# Altium schematic sheet SQUID_Channel_DACS.SchDoc: References and DACs
size Letter; PageSetup: Record=PageOptions|CenterHorizontal=True|CenterVertical=True|PrintScale=1.00|XCorrection=1.00|YCorrection=1.00|PrintKind=1|BorderSize=5000000|LeftOffset=0|BottomOffset=0|Orientation=2|PaperLength=1000|PaperWidth=1000|Scale=100|PaperSource=7|PrintQuality=-4|MediaType=1|DitherType=10|PaperKind=Letter|PrintScaleMode=1; Author: Adam Gilbert; CompanyName: McGill University; DrawnBy: J.-F. Cliche & Adam Gilbert; Organization: Altium Limited; Address1: McGill Cosmology; Address2: 3600 University Street; Address3: Montreal, Quebec; Address4: Canada; DocumentNumber: 3; Revision: Rev2; SheetNumber: 3; SheetTotal: 5; ProjectTitle: DAN Squid Controller; ProjectName: DAN Squid Controller
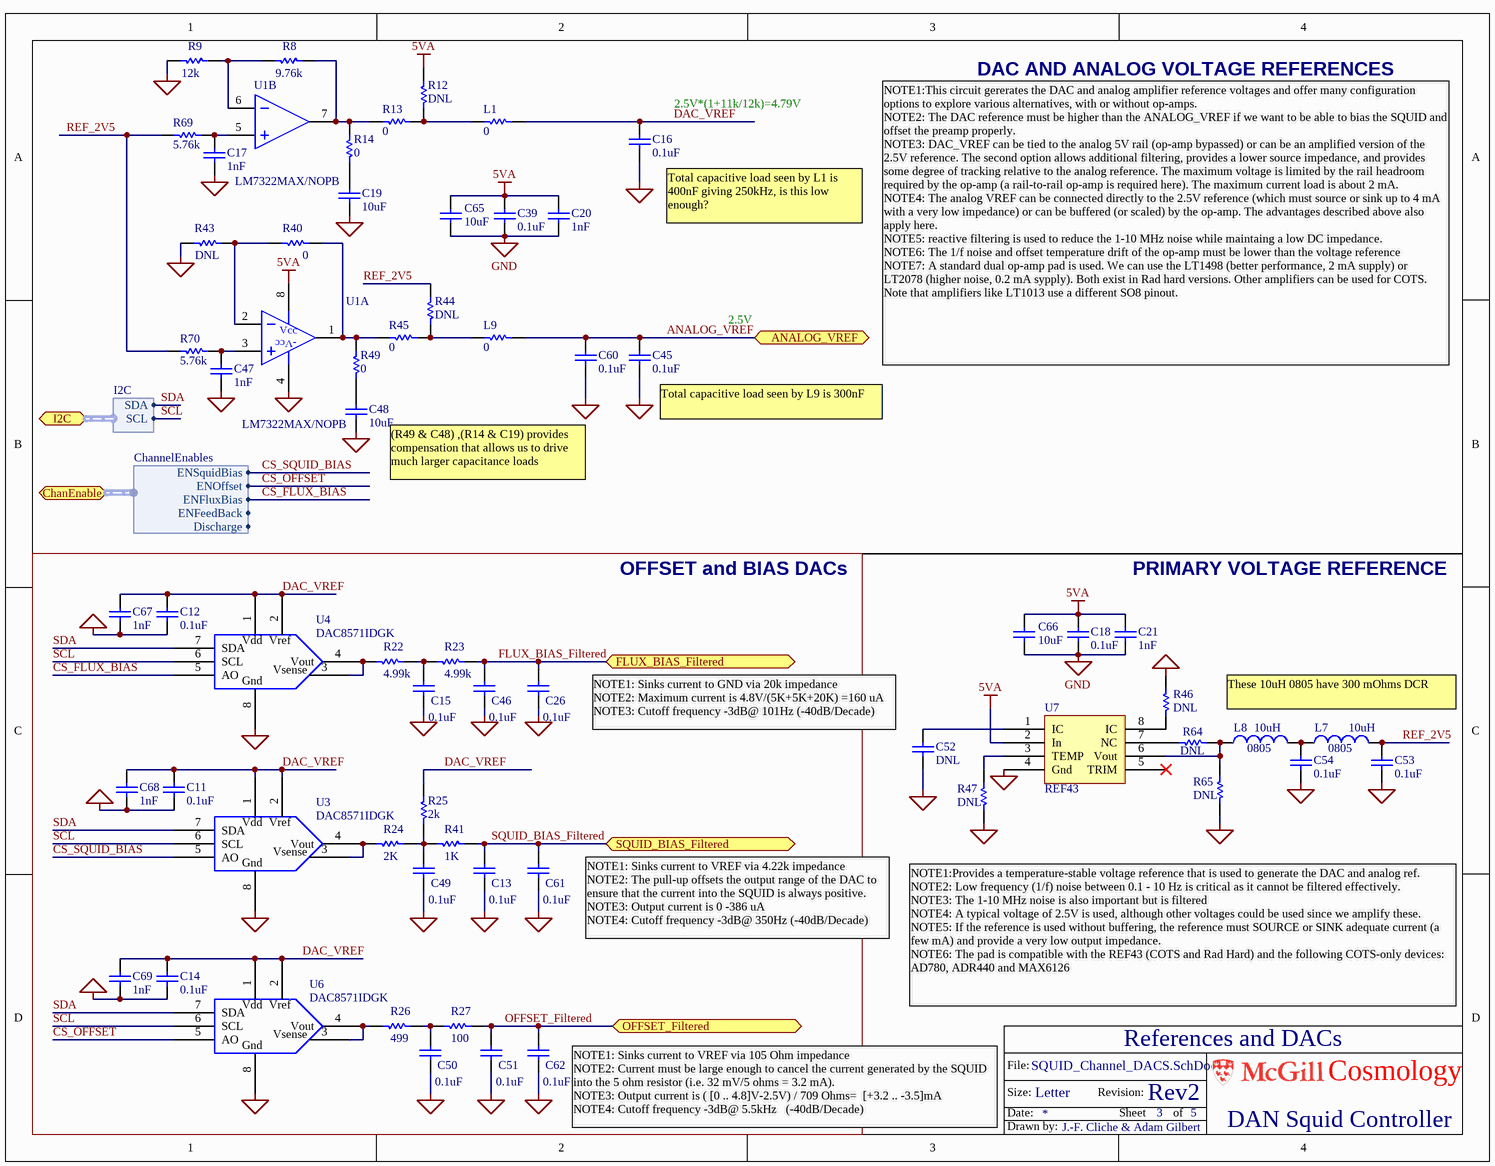
[diagram p0: SQUID_Channel_DACS.SchDoc]

## Parts
C11  0.1uF  [0603]
C12  0.1uF  [0603]
C13  0.1uF  [0603]
C14  0.1uF  [0603]
C15  0.1uF  [0603]
C16  0.1uF  [0603]
C17  1nF  [0603]
C18  0.1uF  [0603]
C19  10uF  [0603]
C20  1nF  [0603]
C21  1nF  [0603]
C26  0.1uF  [0603]
C39  0.1uF  [0603]
C45  0.1uF  [0603]
C46  0.1uF  [0603]
C47  1nF  [0603]
C48  10uF  [0603]
C49  0.1uF  [0603]
C50  0.1uF  [0603]
C51  0.1uF  [0603]
C52  DNL  [0603]
C53  0.1uF  [0603]
C54  0.1uF  [0603]
C60  0.1uF  [0603]
C61  0.1uF  [0603]
C62  0.1uF  [0603]
C65  value 10uF  [CC3225-1210]  (hidden comment: 10uF, 1210)
C66  value 10uF  [CC3225-1210]  (hidden comment: 10uF, 1210)
C67  1nF  [0603]
C68  1nF  [0603]
C69  1nF  [0603]
L1  0  [0603]
L7  10uH  [0805]
L8  10uH  [0805]
L9  0  [0603]
R8  9.76k  [0603]
R9  12k  [0603]
R12  DNL  [0603]
R13  0  [0603]
R14  0  [0603]
R22  4.99k  [0603]
R23  4.99k  [0603]
R24  2k  [0603]
R25  2k  [0603]
R26  499  [0603]
R27  100  [0603]
R40  0  [0603]
R41  1k  [0603]
R43  DNL  [0603]
R44  DNL  [0603]
R45  0  [0603]
R46  DNL  [0603]
R47  DNL  [0603]
R49  0  [0603]
R64  DNL  [0603]
R65  DNL  [0603]
R69  5.76k  [0603]
R70  5.76k  [0603]
U1  LM7322MAX/NOPB  [SO8]  (parts A,B of 2)
U3  DAC8571IDGK  [MSOP-8]
U4  DAC8571IDGK  [MSOP-8]
U6  DAC8571IDGK  [MSOP-8]
U7  REF43  [SO8]

## Blocks framed on the sheet
OFFSET and BIAS DACs: C11-C15 C26 C46 C49-C51 C61 C62 C67-C69 R22-R27 R41 U3 U4 U6

## Ports
ANALOG_VREF, ChanEnable (harness ChannelEnables), FLUX_BIAS_Filtered, I2C (harness I2C), OFFSET_Filtered, SQUID_BIAS_Filtered

## Harnesses
I2C: SDA, SCL
ChannelEnables: ENSquidBias, ENOffset, ENFluxBias, ENFeedBack, Discharge

## Nets
5VA: C18.2 C20.2 C21.2 C39.2 C65.2 C66.2 R12.1 U1.8(VDD) U7.2(In)
GND: C11.2 C12.2 C13.2 C14.1 C15.2 C16.1 C17.1 C18.1 C19.1 C20.1 C21.1 C26.2 C39.1 C45.1 C46.2 C47.1 C48.1 C49.2 C50.2 C51.2 C52.1 C53.1 C54.1 C60.1 C61.2 C62.2 C65.1 C66.1 C67.1 C68.1 C69.1 R9.2 R43.2 R46.2 R47.1 R65.1 U1.4(GND) U3.8(Gnd) U4.8(Gnd) U6.8(Gnd) U7.4(Gnd)
ANALOG_VREF: C45.2 C60.2 L9.1 ; port ANALOG_VREF
CS_FLUX_BIAS: U4.5(AO) ; port ChanEnable.ENFluxBias
CS_OFFSET: U6.5(AO) ; port ChanEnable.ENOffset
CS_SQUID_BIAS: U3.5(AO) ; port ChanEnable.ENSquidBias
DAC_VREF: C11.1 C12.1 C14.2 C16.2 C67.2 C68.2 C69.2 L1.1 R25.2 U3.1(Vdd) U3.2(Vref) U4.1(Vdd) U4.2(Vref) U6.1(Vdd) U6.2(Vref)
FLUX_BIAS_Filtered: C26.1 C46.1 R23.2 ; port FLUX_BIAS_Filtered
OFFSET_Filtered: C51.1 C62.1 R27.2 ; port OFFSET_Filtered
REF_2V5: C53.2 L7.1 R44.1 R69.2 R70.2
SCL: U3.6(SCL) U4.6(SCL) U6.6(SCL) ; port I2C.SCL
SDA: U3.7(SDA) U4.7(SDA) U6.7(SDA) ; port I2C.SDA
SQUID_BIAS_Filtered: C13.1 C61.1 R41.2 ; port SQUID_BIAS_Filtered
NetC15_1: C15.1 R22.2 R23.1
NetC17_2: C17.2 R69.1 U1.5(IN+)
NetC19_2: C19.2 R14.2
NetC47_2: C47.2 R70.1 U1.3(IN+)
NetC48_2: C48.2 R49.2
NetC49_1: C49.1 R24.2 R25.1 R41.1
NetC50_1: C50.1 R26.2 R27.1
NetC52_2: C52.2 U7.1(IC)
NetC54_2: C54.2 L7.2 L8.1
NetL1_2: L1.2 R12.2 R13.2
NetL8_2: L8.2 R64.1 R65.2 U7.6(Vout)
NetL9_2: L9.2 R44.2 R45.2
NetR8_1: R8.1 R9.1 U1.6(IN-)
NetR8_2: R8.2 R13.1 R14.1 U1.7(OUT)
NetR22_1: R22.1 U4.3(Vsense) U4.4(Vout)
NetR24_1: R24.1 U3.3(Vsense) U3.4(Vout)
NetR26_1: R26.1 U6.3(Vsense) U6.4(Vout)
NetR40_1: R40.1 R43.1 U1.2(IN-)
NetR40_2: R40.2 R45.1 R49.1 U1.1(OUT)
NetR46_1: R46.1 U7.8(IC)
NetR47_2: R47.2 U7.3(TEMP)
NetR64_2: R64.2 U7.7(NC)

Not connected (* = marked no-connect by the designer): U7 5(TRIM)*

## Notes on the sheet
- DAC AND ANALOG VOLTAGE REFERENCES
- (near C16) 2.5V*(1+11k/12k)=4.79V
- (near C16) Total capacitive load seen by L1 is 400nF giving 250kHz, is this low enough?
- 2.5V
- NOTE1:This circuit gererates the DAC and analog amplifier reference voltages and offer many configuration options to explore various alternatives, with or without op-amps.
  NOTE2: The DAC reference must be higher than the ANALOG_VREF if we want to be able to bias the SQUID and offset the preamp properly.
  NOTE3: DAC_VREF can be tied to the analog 5V rail (op-amp bypassed) or can be an amplified version of the  2.5V reference. The second option allows additional filtering, provides a lower source impedance, and provides some degree of tracking relative to the analog reference. The maximum voltage is limited by the rail headroom required by the op-amp (a rail-to-rail op-amp is required here). The maximum current load is about 2 mA.
  NOTE4: The analog VREF can be connected directly to the 2.5V reference (which must source or sink up to 4 mA with a very low impedance) or can be buffered (or scaled) by the op-amp. The advantages described above also apply here.
  NOTE5: reactive filtering is used to reduce the 1-10 MHz noise while maintaing a low DC impedance.
  NOTE6: The 1/f noise and offset temperature drift of the op-amp must be lower than the voltage reference
  NOTE7: A standard dual op-amp pad is used. We can use the LT1498 (better performance, 2 mA supply) or LT2078 (higher noise, 0.2 mA sypply). Both exist in Rad hard versions. Other amplifiers can be used for COTS. Note that amplifiers like LT1013 use a different SO8 pinout.
- (near C45) Total capacitive load seen by L9 is 300nF
- (near C48) (R49 & C48) ,(R14 & C19) provides compensation that allows us to drive much larger capacitance loads
- PRIMARY VOLTAGE REFERENCE
- These 10uH 0805 have 300 mOhms DCR
- (near C52) NOTE1: Sinks current to GND via 20k impedance
  NOTE2: Maximum current is 4.8V/(5K+5K+20K) =160 uA
  NOTE3: Cutoff frequency -3dB@ 101Hz (-40dB/Decade)
- (near C61) NOTE1: Sinks current to VREF via 4.22k impedance
  NOTE2: The pull-up offsets the output range of the DAC to ensure that the current into the SQUID is always positive.
  NOTE3: Output current is 0 -386 uA
  NOTE4: Cutoff frequency -3dB@ 350Hz (-40dB/Decade)
- NOTE1:Provides a temperature-stable voltage reference that is used to generate the DAC and analog ref.
  NOTE2: Low frequency (1/f) noise between 0.1 - 10 Hz is critical as it cannot be filtered effectively.
  NOTE3: The 1-10 MHz noise is also important but is filtered
  NOTE4: A typical voltage of 2.5V is used, although other voltages could be used since we amplify these.
  NOTE5: If the reference is used without buffering, the reference must SOURCE or SINK adequate current (a few mA) and provide a very low output impedance.
  NOTE6: The pad is compatible with the REF43 (COTS and Rad Hard) and the following COTS-only devices:  AD780, ADR440 and MAX6126
- (near C62) NOTE1: Sinks current to VREF via 105 Ohm impedance
  NOTE2: Current must be large enough to cancel the current generated by the SQUID into the 5 ohm resistor (i.e. 32 mV/5 ohms = 3.2 mA).
  NOTE3: Output current is ( [0 .. 4.8]V-2.5V) / 709 Ohms=  [+3.2 .. -3.5]mA
  NOTE4: Cutoff frequency -3dB@ 5.5kHz   (-40dB/Decade)
- File:
- Size:
- Date:
- Letter
- Revision:
- Sheet
- of
- Cosmology
- Drawn by:
- (in symbol LMH6628, part A) Vcc; -Vcc

## Library data of the parts
C11-C15 C18 C26 C39 C46 C49-C54 C61 C62 = Cap0603: Capacitor, Ceramic, 0603; Part Constraints: 0.1uF 16V 10% X7R; Manufacturer: Generic; Supplier 1: Digi-Key; Supplier Part Number 1: 399-1096-1-ND
  C11-C15 C18 C26 C39 C46 C49-C51 C53 C54 C61 C62: Value: 0.1uF
  C52: Value: DNL
C16 C45 C60 = Cap0603: Capacitor, Ceramic, 0603; Manufacturer: Generic; Part Constraints: 0.1uF 16V 10% X7R; Supplier 1: Digi-Key; Supplier Part Number 1: 399-1096-1-ND; Value: 0.1uF
C17 C20 C21 C47 C67-C69 = Cap0603: Capacitor, Ceramic, 0603; Part Constraints: 1nF 50V 10% X7R 0603; Manufacturer: Generic; Value: 1nF; Supplier 1: Digi-Key; Supplier Part Number 1: 399-1082-1-ND
C19 C48 = Cap0603: Capacitor, Ceramic, 0603; Manufacturer: Generic; Part Constraints: CAP CER 10UF 10V 20% X5R 0603; Supplier 1: Digi-Key; Supplier Part Number 1: 587-2562-1-ND; Value: 10uF
C65 C66 = CAP 1210: Capacitor, Ceramic, 1210; Manufacturer Part Number: 1206YD106KAT2A; Manufacturer: AVX Corporation; Part Constraints: 10uF 1210 16V X5R <=1.78mm height; Voltage: 16V; Footprint: 1210; Supplier 1: Digikey; Supplier Part Number 1: 478-1573-1-ND
L1 L9 R13 R14 R40 R45 R49 = Res0603: RES 0603; Manufacturer: Generic; Part constraints: 0 1/10W 1% 100ppm/C 0603; Manufacturer Part Number 1: e.g CRCW0603 series; Value: 0; Supplier 1: Digi-Key; Supplier Part Number 1: 541-0.0GCT-ND
L7 L8 = Inductor0603: Inductor 0805; PartConstraints: INDUCTOR 10UH 100MA 20% 0805; Manufacturer: TDK Corporation; Part Constraints: GLFR2012T100M-LR; Resistance: <300mOhm; CurrentRating: 100mA; Inductance: 10uH; Supplier 1: Digi-Key; Supplier Part Number 1: 445-3614-1-ND
R8 = Res0603: RES 0603; Manufacturer: Generic; Part Constraints: RES 9.76K OHM 1/10W 1% 0603 SMD; Manufacturer Part Number 1: e.g CRCW0603 series; Value: 9.76k; Supplier 1: Digi-Key; Supplier Part Number 1: 541-9.76KHCT-ND
R9 = RES 0603: Manufacturer: Generic; Part Constraints: RES 12.0K OHM 1/10W 1% 0603 SMD; Manufacturer Part Number 1: e.g CRCW0603 series; Value: 12k; Supplier 1: Digi-Key; Supplier Part Number 1: 541-12.0KHCT-ND
R12 R44 = Res0603: RES 0603; Manufacturer: Generic; Manufacturer Part Number 1: e.g CRCW0603 series; Value: DNL; Part constraints: DNL
R22 R23 = Res0603: RES 0603; Manufacturer: Generic; Part constraints: RES 4.99K OHM 1/10W 1% 0603 SMD; Manufacturer Part Number 1: e.g CRCW0603 series; Value: 4.99k; Supplier 1: Digi-Key; Supplier Part Number 1: 541-4.99KHCT-ND
R24 R25 = Res0603: RES 0603; Manufacturer: Generic; Part constraints: RES 2.00K OHM 1/10W 1% 0603 SMD; Manufacturer Part Number 1: e.g CRCW0603 series; Supplier 1: Digi-Key; Supplier Part Number 1: 541-2.00KHCT-ND
  R24: Value: 2K
  R25: Value: 2k
R26 = Res0603: RES 0603; Manufacturer: Generic; Manufacturer Part Number 1: e.g CRCW0603 series; Part constraints: 499 1/10W 1% 100ppm/C 0603; Value: 499; Supplier 1: Digi-Key; Supplier Part Number 1: 541-499HCT-ND
R27 = Res0603: RES 0603; Manufacturer: Generic; Manufacturer Part Number 1: e.g CRCW0603 series; Part constraints: RES 100 OHM 1/10W 1% 0603 SMD; Value: 100; Supplier 1: Digi-Key; Supplier Part Number 1: 541-100HCT-ND
R41 = Res0603: RES 0603; Manufacturer: Generic; Part constraints: 1K 1/10W 1% 100ppm/C 0603; Manufacturer Part Number 1: e.g CRCW0603 series; Value: 1K; Supplier 1: Digi-Key; Supplier Part Number 1: 541-1.00KHTR-ND
R43 R47 R65 = RES 0603: Manufacturer: Generic; Manufacturer Part Number 1: e.g CRCW0603 series; Value: DNL; Part constraints: DNL
R46 = RES 0603: Manufacturer: Generic; Manufacturer Part Number 1: e.g CRCW0603 series; Tolerance: 1%; Power: 1/10W; TempCoef: 100ppm/C; Value: DNL; Part Constraints: DNL
R64 = RES 0603: Manufacturer: Generic; Manufacturer Part Number 1: e.g CRCW0603 series; Part constraints: 0 1/10W 1% 100ppm/C 0603; Value: DNL; Supplier 1: Digi-Key; Supplier Part Number 1: 541-0.0GCT-ND
R69 R70 = Res0603: RES 0603; Manufacturer: Generic; Part Constraints: RES 5.76K OHM 1/10W 1% 0603 SMD; Manufacturer Part Number 1: e.g CRCW0603 series; Value: 5.76k; Supplier 1: Digi-Key; Supplier Part Number 1: 541-5.76KHCT-ND
U1 = LMH6628: IC OP AMP DUAL 2CH LN 8-SOIC; Manufacturer: Texas Instruments; Amplifier Type: Voltage Feedback; Number of Circuits: 2; Category: Integrated Circuits (ICs); Output Type: -; Operating Temperature: -40°C ~ 85°C; Mounting Type: Surface Mount; Package / Case: 8-SOIC (0.154", 3.90mm Width); Supplier Device Package: 8-SOIC; Packaging: Tube; Supplier 1: Digi-Key; Supplier Part Number 1: 296-35309-1-ND; Part Constraints: LM7322MAX/NOPB
U3 U4 U6 = DAC8571IDGKR: IC DAC 16BIT I2C V-OUT LP 8-MSOP; Manufacturer 1: Texas Instruments; Category 1: Integrated Circuits (ICs); Settling Time: 12µs; Number of Bits: 16; Data Interface: I²C, Serial; Number of Converters: 1; Voltage Supply Source: Single Supply; Number of Outputs and Type: 1 Voltage, Unipolar; Sampling Rate (Per Second): 43k; Supplier 1: Digi-Key; Manufacturer Part Number 1: DAC8571IDGKR; RoHS 1: RoHS Compliant; Description 1: IC DAC 16BIT I2C V-OUT LP 8-MSOP; Stock 1: 21077; Pricing 1: 1=7.6, 10=6.839, 25=6.2192, 100=3.9792, 250=3.9054, 500=3.83172, 750=3.75803 (CAD); Power Dissipation (Max): -; Operating Temperature: -40°C ~ 105°C; Mounting Type: Surface Mount; Package / Case: 8-TSSOP, 8-MSOP (0.118", 3.00mm Width); Supplier Device Package: 8-MSOP; Packaging: Cut Tape (CT); ComponentLink1URL: http://www.ti.com/lit/ds/symlink/dac8571.pdf; ComponentLink1Description: http://www.ti.com/lit/ds/symlink/dac8571.pdf; Supplier Part Number 1: 296-14307-1-ND
U7 = REF43: Voltage Referance; Part Constraints: REF43GSZ; Supplier 1: Digi-Key; Supplier Part Number 1: REF43GSZ-ND